# EAGLE schematic controller_rev1.1(flat) (EAGLE 9.0.0)

## Sheet 1 of 3
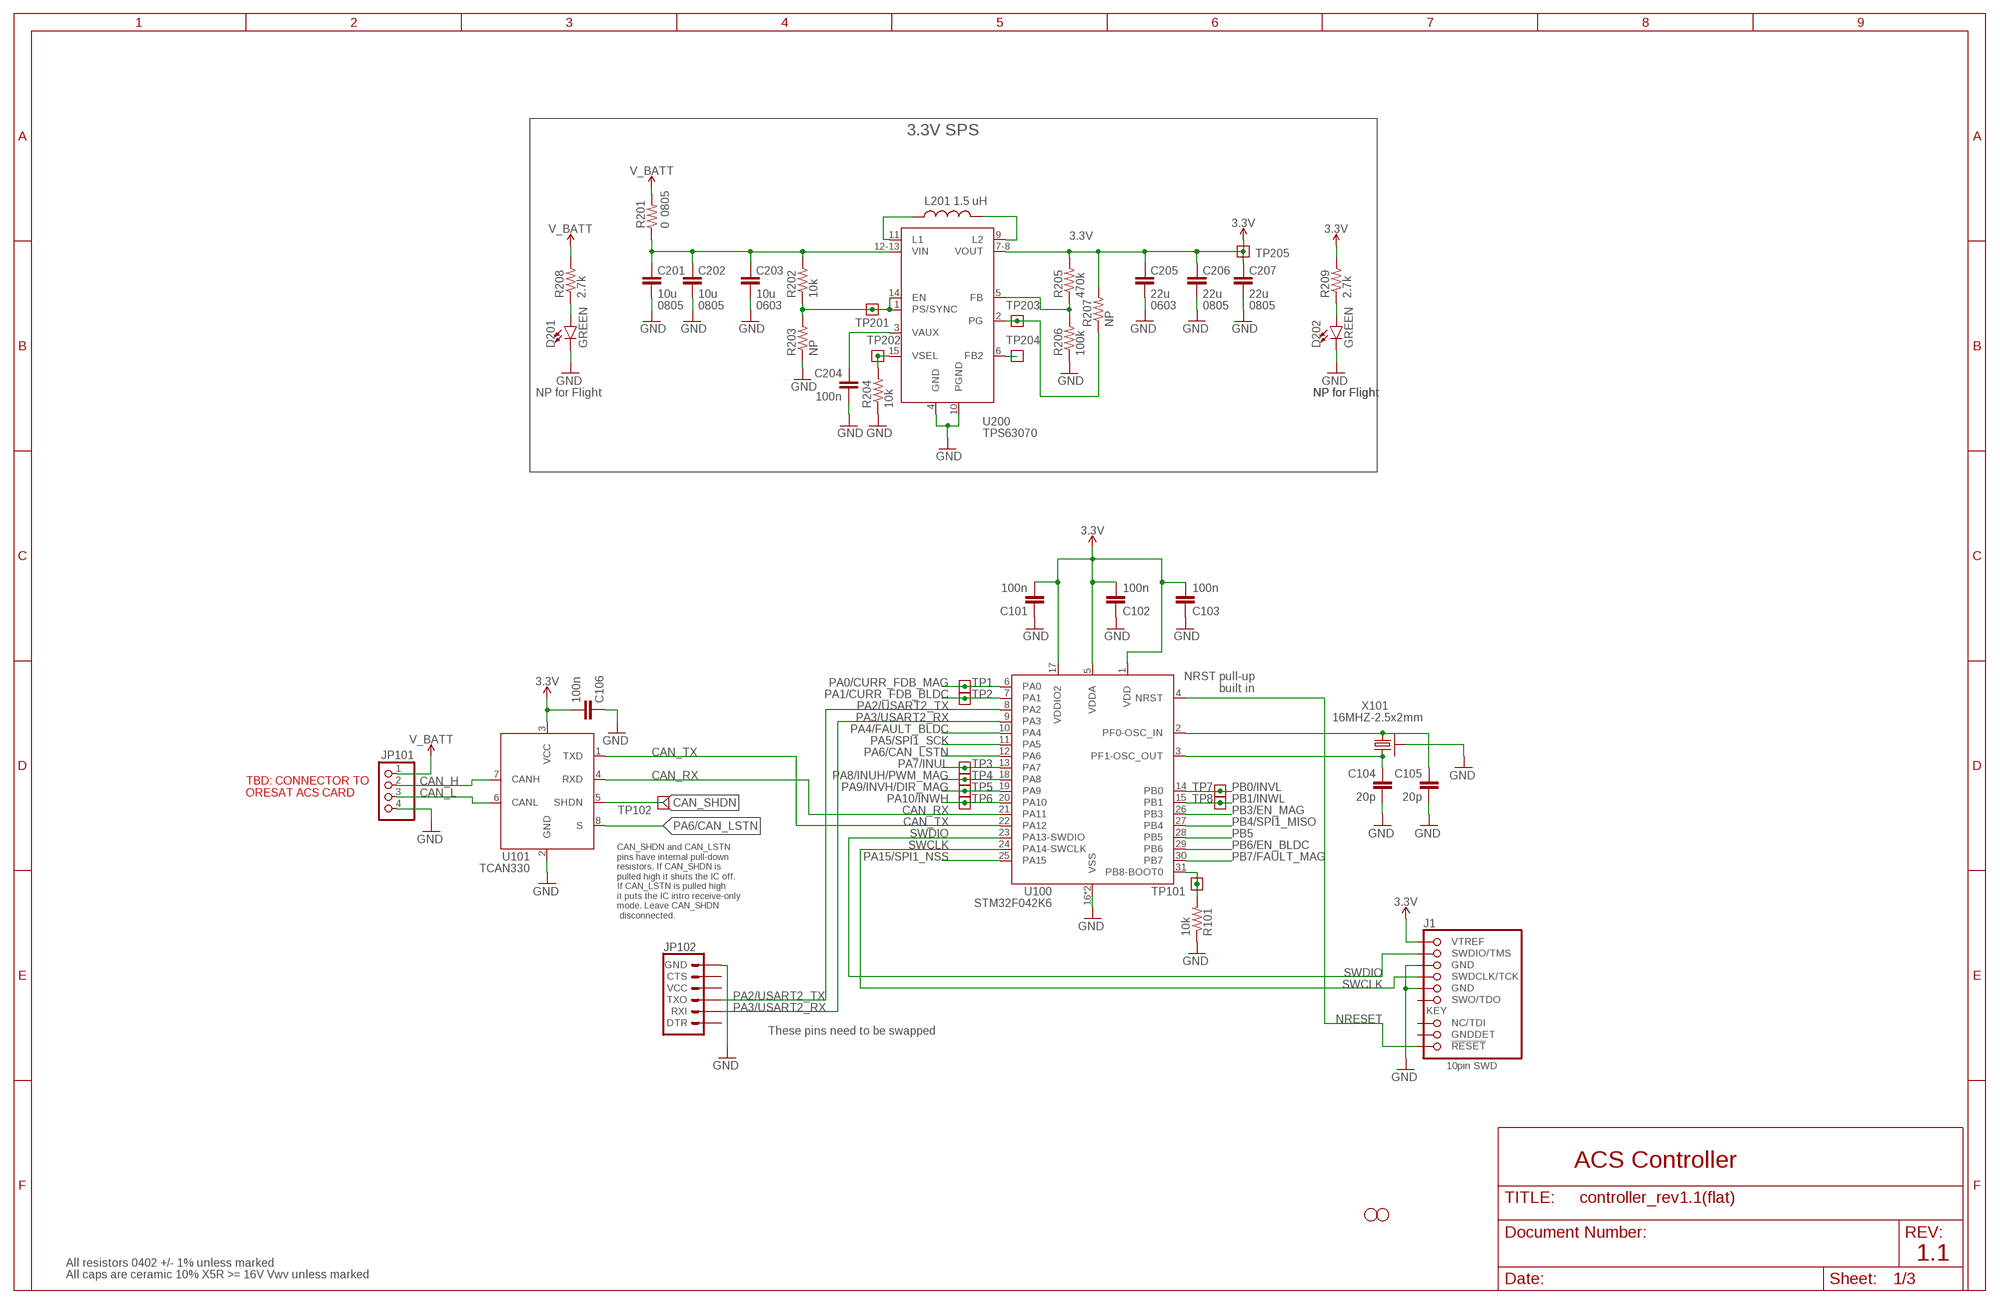
[diagram p0: schematic, sheet 1]

### Parts
C101  100n  C-EU0402-B-NOSILK  [.0402-B-NOSILK]
C102  100n  C-EU0402-B-NOSILK  [.0402-B-NOSILK]
C103  100n  C-EU0402-B-NOSILK  [.0402-B-NOSILK]
C104  20p  C-EU0402-B-NOSILK  [.0402-B-NOSILK]
C105  20p  C-EU0402-B-NOSILK  [.0402-B-NOSILK]
C106  100n  C-EU0402-B-NOSILK  [.0402-B-NOSILK]
C201  10u  C-EU0805-B-NOSILK  [.0805-B-NOSILK]
C202  10u  C-EU0805-B-NOSILK  [.0805-B-NOSILK]
C203  10u  C-EU0603-B-NOSILK  [.0603-B-NOSILK]
C204  100n  C-EU0402-B-NOSILK  [.0402-B-NOSILK]
C205  22u  C-EU0603-B-NOSILK  [.0603-B-NOSILK]
C206  22u  C-EU0805-B-NOSILK  [.0805-B-NOSILK]
C207  22u  C-EU0805-B-NOSILK  [.0805-B-NOSILK]
D201  GREEN  LED-GREEN0603  [LED-0603]
D202  GREEN  LED-GREEN0603  [LED-0603]
H1  STAND-OFFTIGHT  [STAND-OFF-TIGHT]
H2  STAND-OFFTIGHT  [STAND-OFF-TIGHT]
J1  1.27MM-SWD-CONNECTOR  [1.27MM_2X5]
JP101  PINHD-1X4  [1X04]
JP102  6_PIN_SERIAL_TARGETSILK  [6_PIN_SERIAL_TARGET_SIDE_W_SILK]
L201  1.5 uH  L-COILCRAFT-XFL4020  [L-COILCRAFT-XFL4020]
R101  10k  R-US_0402-B-NOSILK  [.0402-B-NOSILK]
R201  0  R-US_0805-B-NOSILK  [.0805-B-NOSILK]
R202  10k  R-US_0402-B-NOSILK  [.0402-B-NOSILK]
R203  NP  R-US_0402-B-NOSILK  [.0402-B-NOSILK]
R204  10k  R-US_0402-B-NOSILK  [.0402-B-NOSILK]
R205  470k  R-US_0402-B-NOSILK  [.0402-B-NOSILK]
R206  100k  R-US_0402-B-NOSILK  [.0402-B-NOSILK]
R207  NP  R-US_0402-B-NOSILK  [.0402-B-NOSILK]
R208  2.7k  R-US_0402-B-NOSILK  [.0402-B-NOSILK]
R209  2.7k  R-US_0402-B-NOSILK  [.0402-B-NOSILK]
TP1  TEST-POINT  [2MM-TEST-POINT]
TP2  TEST-POINT  [2MM-TEST-POINT]
TP3  TEST-POINT  [2MM-TEST-POINT]
TP4  TEST-POINT  [2MM-TEST-POINT]
TP5  TEST-POINT  [2MM-TEST-POINT]
TP6  TEST-POINT  [2MM-TEST-POINT]
TP7  TEST-POINT  [2MM-TEST-POINT]
TP8  TEST-POINT  [2MM-TEST-POINT]
TP101  TEST-POINT  [2MM-TEST-POINT]
TP102  TEST-POINT  [2MM-TEST-POINT]
TP201  TEST-POINT  [2MM-TEST-POINT]
TP202  TEST-POINT  [2MM-TEST-POINT]
TP203  TEST-POINT  [2MM-TEST-POINT]
TP204  TEST-POINT  [2MM-TEST-POINT]
TP205  TEST-POINT  [2MM-TEST-POINT]
U100  STM32F042K6  [QFP32-7X7]
U101  TCAN330  [SOT23-8_TI-DCN]
U200  TPS63070  TPS63070X  [TPS63070X]
X101  16MHZ-2.5x2mm  CRYSTAL-WITH-GND  [CRYSTAL_2.5X2]

### Nets
3.3V: C101.2 C102.2 C103.2 C106.2 C205.1 C206.1 C207.1 J1.VTREF R205.2 R207.2 R209.2 TP205.1 U100.1(VDD) U100.5(VDDA) U100.17(VDDIO2) U101.3(VCC) U200.7-8(VOUT) ; also sheet 2,3
BOOT: R101.2 TP101.1 U100.31(PB8-BOOT0)
CAN_H: JP101.2 U101.7(CANH)
CAN_L: JP101.3 U101.6(CANL)
CAN_RX: U100.21(PA11) U101.4(RXD)
CAN_SHDN: TP102.1 U101.5(SHDN)
CAN_TX: U100.22(PA12) U101.1(TXD)
CRYSTALIN: C105.1 U100.2(PF0-OSC_IN) X101.1
CRYSTALOUT: C104.1 U100.3(PF1-OSC_OUT) X101.3
GND: C101.1 C102.1 C103.1 C104.2 C105.2 C106.1 C201.2 C202.2 C203.2 C204.2 C205.2 C206.2 C207.2 D201.C D202.C J1.GND J1.GND@2(GND) JP101.4 JP102.P$6(GND) R101.1 R203.1 R204.1 R206.1 U100.16(VSS) U100.32(VSS) U101.2(GND) U200.4(GND) U200.10(PGND) X101.2(SHIELD) X101.4(SHIELD) ; also sheet 2,3
N$270: D201.A R208.1
N$271: D202.A R209.1
NRESET: J1.!RESET U100.4(NRST)
PA0/CURR_FDB_MAG: TP1.1 U100.6(PA0) ; also sheet 3
PA1/CURR_FDB_BLDC: TP2.1 U100.7(PA1) ; also sheet 2
PA2/USART2_TX: JP102.P$2(TXO) U100.8(PA2)
PA3/USART2_RX: JP102.P$3(RXI) U100.9(PA3)
PA4/FAULT_BLDC: U100.10(PA4) ; also sheet 2
PA5/SPI1_SCK: U100.11(PA5) ; also sheet 2
PA6/CAN_LSTN: U100.12(PA6) U101.8(S)
PA7/INUL: TP3.1 U100.13(PA7) ; also sheet 2
PA8/INUH/PWM_MAG: TP4.1 U100.18(PA8) ; also sheet 2,3
PA9/INVH/DIR_MAG: TP5.1 U100.19(PA9) ; also sheet 2,3
PA10/INWH: TP6.1 U100.20(PA10) ; also sheet 2
PA15/SPI1_NSS: U100.25(PA15) ; also sheet 2
PB0/INVL: TP7.1 U100.14(PB0) ; also sheet 2
PB1/INWL: TP8.1 U100.15(PB1) ; also sheet 2
PB3/EN_MAG: U100.26(PB3) ; also sheet 3
PB4/SPI1_MISO: U100.27(PB4) ; also sheet 2
PB5: U100.28(PB5)
PB6/EN_BLDC: U100.29(PB6) ; also sheet 2
PB7/FAULT_MAG: U100.30(PB7) ; also sheet 3
SWCLK: J1.SWDCLK(SWDCLK/TCK) U100.24(PA14-SWCLK)
SWDIO: J1.SWDIO(SWDIO/TMS) U100.23(PA13-SWDIO)
TPS-EN: R202.1 R203.2 TP201.1 U200.1(PS/SYNC) U200.14(EN)
TPS-FB: R205.1 R206.2 U200.5(FB)
TPS-FB2: TP204.1 U200.6(FB2)
TPS-L1: L201.1 U200.11(L1)
TPS-L2: L201.2 U200.9(L2)
TPS-PG: R207.1 TP203.1 U200.2(PG)
TPS-VAUX: C204.1 U200.3(VAUX)
TPS-VIN: C201.1 C202.1 C203.1 R201.1 R202.2 U200.12-13(VIN)
TPS-VSEL: R204.2 TP202.1 U200.15(VSEL)
V_BATT: JP101.1 R201.2 R208.2 ; also sheet 2,3
Unconnected: J1.GNDDET J1.NC(NC/TDI) J1.SWO(SWO/TDO) JP102.P$1(DTR) JP102.P$4(VCC) JP102.P$5(CTS)

### Notes on the sheet
- 3.3V SPS
- 0805
- 0805 | 0805 | 0603 | 0603 | 0805 | 0805
- NP for Flight | NP for Flight | NP for Flight
- NRST pull-up
  built in
- TBD: CONNECTOR TO 
  ORESAT ACS CARD
- CAN_SHDN and CAN_LSTN
  pins have internal pull-down
  resistors. If CAN_SHDN is 
  pulled high it shuts the IC off.
  If CAN_LSTN is pulled high
  it puts the IC intro receive-only
  mode. Leave CAN_SHDN
   disconnected.
- These pins need to be swapped
- ACS Controller
- 1.1
- All resistors 0402 +/- 1% unless marked
- All caps are ceramic 10% X5R >= 16V Vwv unless marked

## Sheet 2 of 3
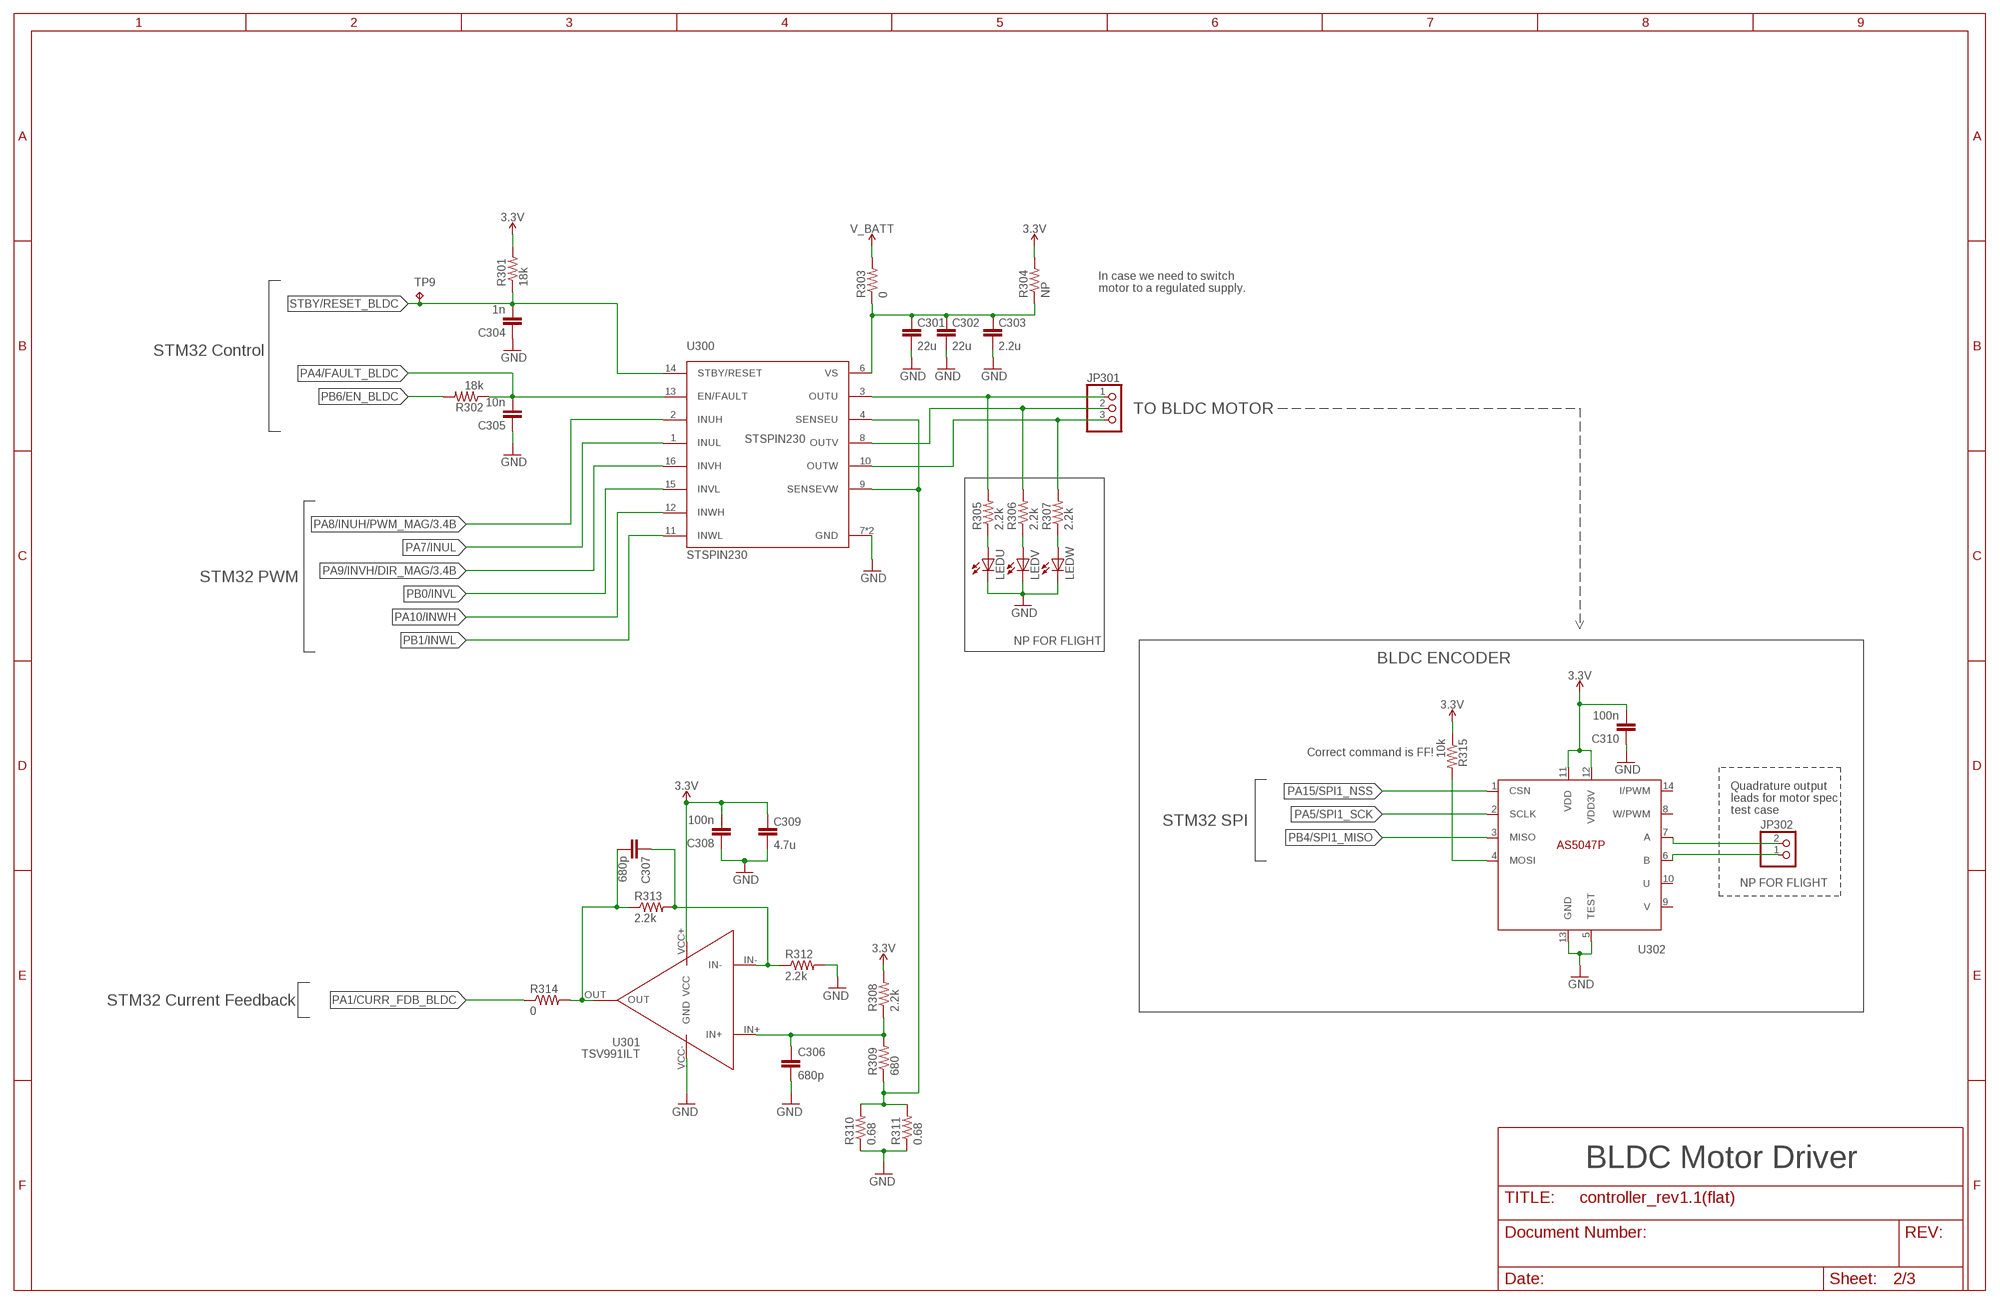
[diagram p1: schematic, sheet 2]

### Parts
C301  22u  C-EU0603-B-NOSILK  [.0603-B-NOSILK]
C302  22u  C-EU0603-B-NOSILK  [.0603-B-NOSILK]
C303  2.2u  C-EU0603-B-NOSILK  [.0603-B-NOSILK]
C304  1n  C-EU0402-B-NOSILK  [.0402-B-NOSILK]
C305  10n  C-EU0402-B-NOSILK  [.0402-B-NOSILK]
C306  680p  C-EU0402-B-NOSILK  [.0402-B-NOSILK]
C307  680p  C-EU0402-B-NOSILK  [.0402-B-NOSILK]
C308  100n  C-EU0402-B-NOSILK  [.0402-B-NOSILK]
C309  4.7u  C-EU0603-B-NOSILK  [.0603-B-NOSILK]
C310  100n  C-EU0402-B-NOSILK  [.0402-B-NOSILK]
JP301  PINHD-1X3  [1X03]
JP302  PINHD-1X2/90  [1X02/90]
LEDU  LEDCHIP-LED0603  [CHIP-LED0603]
LEDV  LEDCHIP-LED0603  [CHIP-LED0603]
LEDW  LEDCHIP-LED0603  [CHIP-LED0603]
R301  18k  R-US_0402-B-NOSILK  [.0402-B-NOSILK]
R302  18k  R-US_0402-B-NOSILK  [.0402-B-NOSILK]
R303  0  R-US_0805-B-NOSILK  [.0805-B-NOSILK]
R304  NP  R-US_0805-B-NOSILK  [.0805-B-NOSILK]
R305  2.2k  R-US_0805-B-NOSILK  [.0805-B-NOSILK]
R306  2.2k  R-US_0805-B-NOSILK  [.0805-B-NOSILK]
R307  2.2k  R-US_0805-B-NOSILK  [.0805-B-NOSILK]
R308  2.2k  R-US_0402-B-NOSILK  [.0402-B-NOSILK]
R309  680  R-US_0402-B-NOSILK  [.0402-B-NOSILK]
R310  0.68  R-US_0805-B-NOSILK  [.0805-B-NOSILK]
R311  0.68  R-US_0805-B-NOSILK  [.0805-B-NOSILK]
R312  2.2k  R-US_0402-B-NOSILK  [.0402-B-NOSILK]
R313  2.2k  R-US_0402-B-NOSILK  [.0402-B-NOSILK]
R314  0  R-US_0402-B-NOSILK  [.0402-B-NOSILK]
R315  10k  R-US_0402-B-NOSILK  [.0402-B-NOSILK]
TP9  TPPAD1-13  [P1-13]
U300  STSPIN230  [VFQFPN]
U301  TSV991ILT  [SOT23-5]
U302  AS5047P  [TSSOP14]

### Nets
3.3V: C308.2 C309.1 C310.2 R301.2 R304.2 R308.2 R315.1 U301.VCC+(VCC) U302.11(VDD) U302.12(VDD3V) ; also sheet 1,3
GND: C301.2 C302.2 C303.2 C304.1 C305.1 C306.2 C308.1 C309.2 C310.1 LEDU.C LEDV.C LEDW.C R310.1 R311.1 R312.2 U300.7(GND) U300.EPAD(GND) U301.VCC-(GND) U302.5(TEST) U302.13(GND) ; also sheet 1,3
N$1: R315.2 U302.4(MOSI)
N$4: JP302.2 U302.7(A)
N$6: LEDU.A R305.1
N$10: LEDV.A R306.1
N$11: LEDW.A R307.1
N$12: C301.1 C302.1 C303.1 R303.1 R304.1 U300.6(VS)
N$13: JP302.1 U302.6(B)
N$14: C307.1 R312.1 R313.2 U301.IN-
N$16: C306.1 R308.1 R309.2 U301.IN+
N$29: C307.2 R313.1 R314.2 U301.OUT
PA1/CURR_FDB_BLDC: R314.1 ; also sheet 1
PA4/FAULT_BLDC: C305.2 R302.1 U300.13(EN/FAULT) ; also sheet 1
PA5/SPI1_SCK: U302.2(SCLK) ; also sheet 1
PA7/INUL: U300.1(INUL) ; also sheet 1
PA8/INUH/PWM_MAG: U300.2(INUH) ; also sheet 1,3
PA9/INVH/DIR_MAG: U300.16(INVH) ; also sheet 1,3
PA10/INWH: U300.12(INWH) ; also sheet 1
PA15/SPI1_NSS: U302.1(CSN) ; also sheet 1
PB0/INVL: U300.15(INVL) ; also sheet 1
PB1/INWL: U300.11(INWL) ; also sheet 1
PB4/SPI1_MISO: U302.3(MISO) ; also sheet 1
PB6/EN_BLDC: R302.2 ; also sheet 1
SENSE_BLDC: R309.1 R310.2 R311.2 U300.4(SENSEU) U300.9(SENSEVW)
STBY/RESET_BLDC: C304.2 R301.1 TP9.TP U300.14(STBY/RESET)
U: JP301.1 R305.2 U300.3(OUTU)
V: JP301.2 R306.2 U300.8(OUTV)
V_BATT: R303.2 ; also sheet 1,3
W: JP301.3 R307.2 U300.10(OUTW)
Unconnected: U302.8(W/PWM) U302.9(V) U302.10(U) U302.14(I/PWM)

### Notes on the sheet
- In case we need to switch 
  motor to a regulated supply.
- STM32 Control
- TO BLDC MOTOR
- STM32 PWM
- NP FOR FLIGHT
- BLDC ENCODER
- Correct command is FF!
- Quadrature output
  leads for motor spec
  test case
- STM32 SPI
- NP FOR FLIGHT
- STM32 Current Feedback
- BLDC Motor Driver

## Sheet 3 of 3
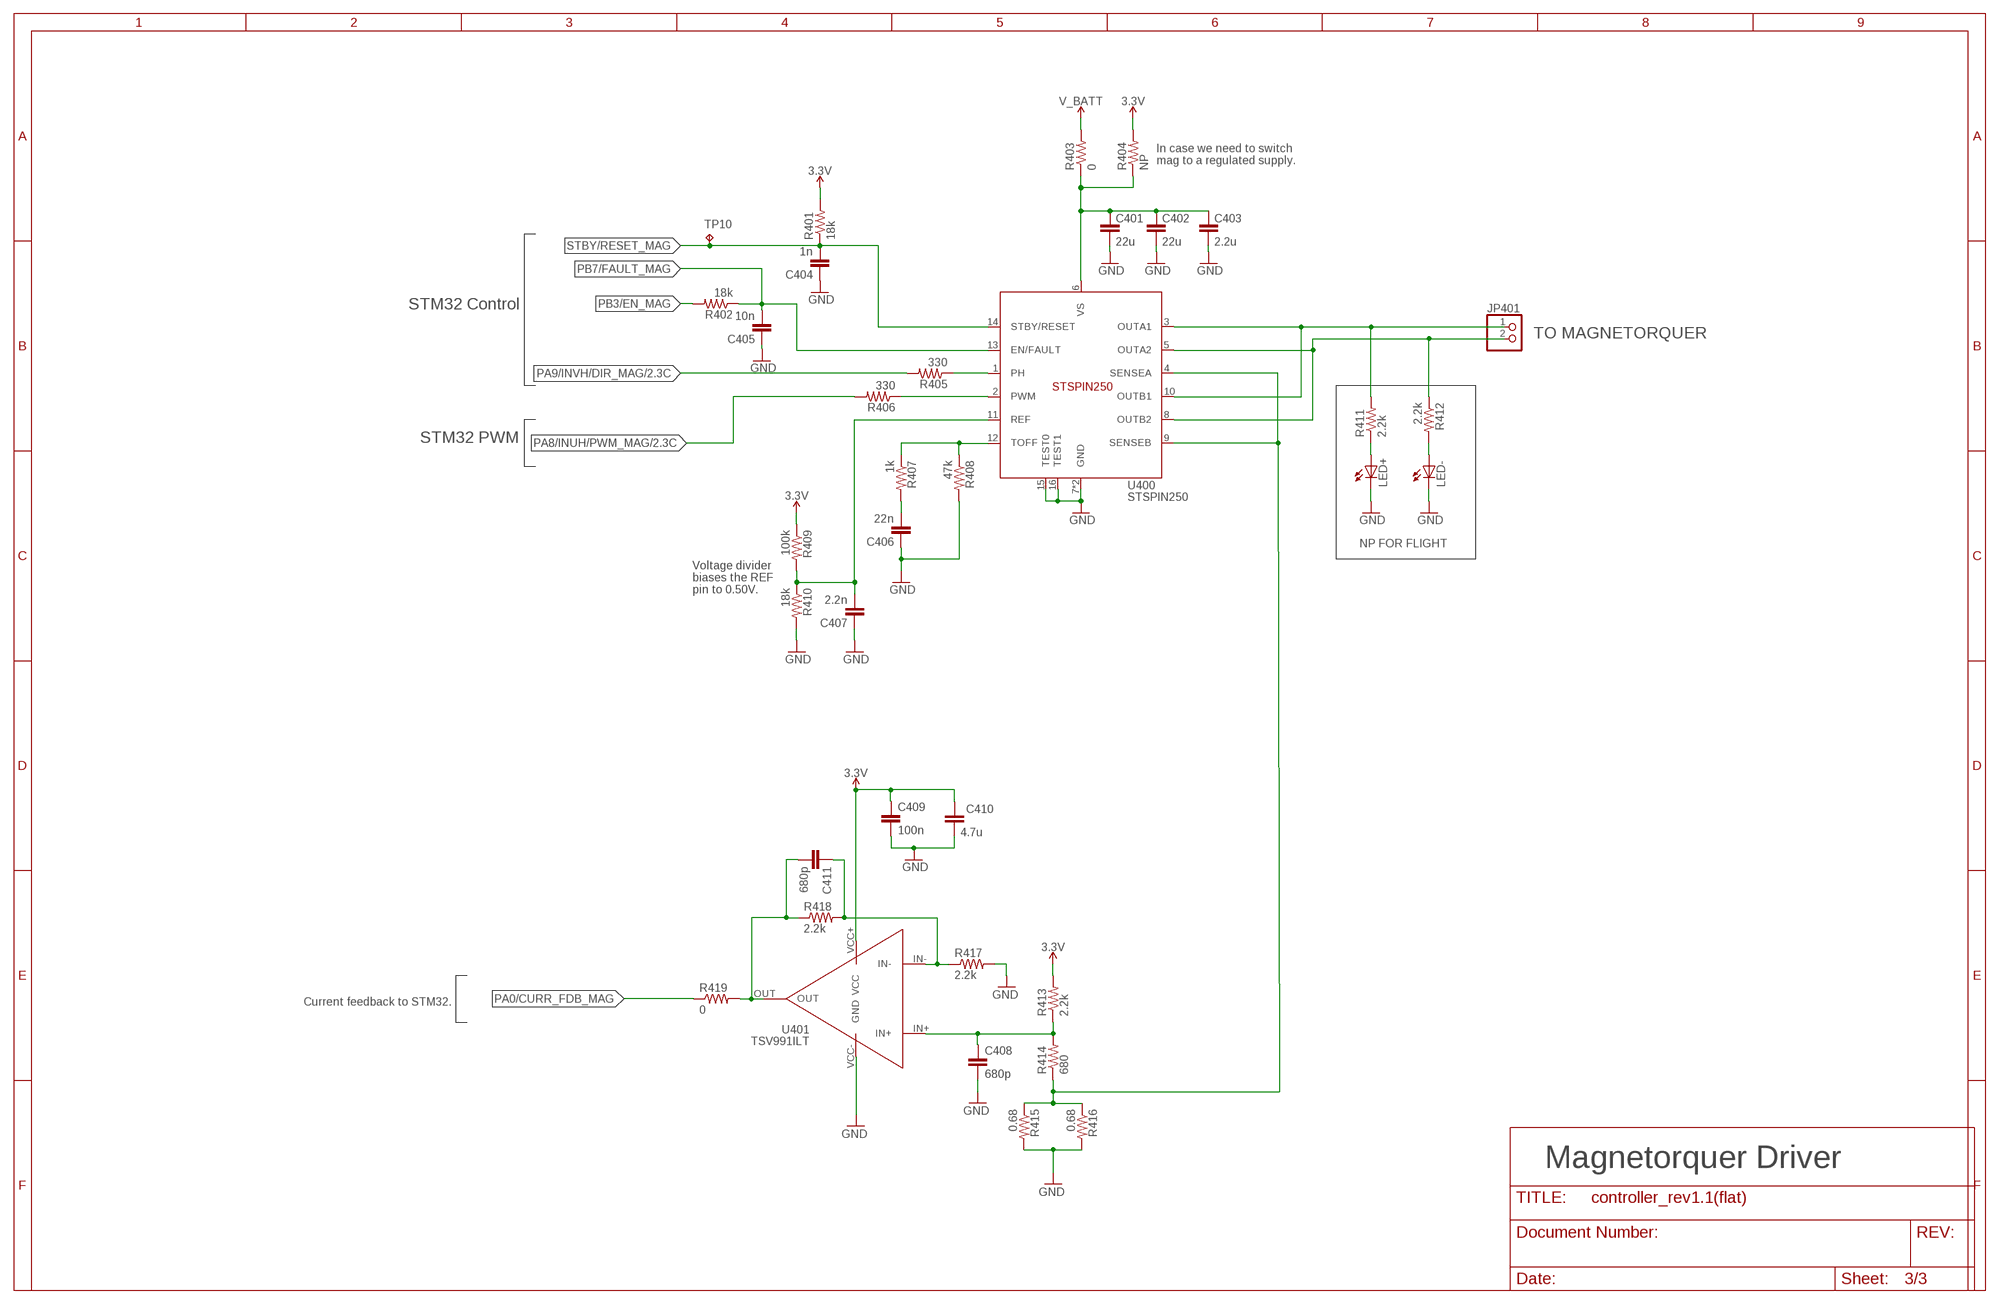
[diagram p2: schematic, sheet 3]

### Parts
C401  22u  C-EU0603-B-NOSILK  [.0603-B-NOSILK]
C402  22u  C-EU0603-B-NOSILK  [.0603-B-NOSILK]
C403  2.2u  C-EU0603-B-NOSILK  [.0603-B-NOSILK]
C404  1n  C-EU0402-B-NOSILK  [.0402-B-NOSILK]
C405  10n  C-EU0402-B-NOSILK  [.0402-B-NOSILK]
C406  22n  C-EU0402-B-NOSILK  [.0402-B-NOSILK]
C407  2.2n  C-EU0402-B-NOSILK  [.0402-B-NOSILK]
C408  680p  C-EU0402-B-NOSILK  [.0402-B-NOSILK]
C409  100n  C-EU0402-B-NOSILK  [.0402-B-NOSILK]
C410  4.7u  C-EU0603-B-NOSILK  [.0603-B-NOSILK]
C411  680p  C-EU0402-B-NOSILK  [.0402-B-NOSILK]
JP401  PINHD-1X2  [1X02]
LED+  LEDCHIP-LED0603  [CHIP-LED0603]
LED-  LEDCHIP-LED0603  [CHIP-LED0603]
R401  18k  R-US_0402-B-NOSILK  [.0402-B-NOSILK]
R402  18k  R-US_0402-B-NOSILK  [.0402-B-NOSILK]
R403  0  R-US_0805-B-NOSILK  [.0805-B-NOSILK]
R404  NP  R-US_0805-B-NOSILK  [.0805-B-NOSILK]
R405  330  R-US_0402-B-NOSILK  [.0402-B-NOSILK]
R406  330  R-US_0402-B-NOSILK  [.0402-B-NOSILK]
R407  1k  R-US_0402-B-NOSILK  [.0402-B-NOSILK]
R408  47k  R-US_0402-B-NOSILK  [.0402-B-NOSILK]
R409  100k  R-US_0402-B-NOSILK  [.0402-B-NOSILK]
R410  18k  R-US_0402-B-NOSILK  [.0402-B-NOSILK]
R411  2.2k  R-US_0805-B-NOSILK  [.0805-B-NOSILK]
R412  2.2k  R-US_0805-B-NOSILK  [.0805-B-NOSILK]
R413  2.2k  R-US_0402-B-NOSILK  [.0402-B-NOSILK]
R414  680  R-US_0402-B-NOSILK  [.0402-B-NOSILK]
R415  0.68  R-US_0805-B-NOSILK  [.0805-B-NOSILK]
R416  0.68  R-US_0805-B-NOSILK  [.0805-B-NOSILK]
R417  2.2k  R-US_0402-B-NOSILK  [.0402-B-NOSILK]
R418  2.2k  R-US_0402-B-NOSILK  [.0402-B-NOSILK]
R419  0  R-US_0402-B-NOSILK  [.0402-B-NOSILK]
TP10  TPPAD1-13  [P1-13]
U400  STSPIN250  [VFQPN]
U401  TSV991ILT  [SOT23-5]

### Nets
3.3V: C409.1 C410.1 R401.2 R404.2 R409.1 R413.2 U401.VCC+(VCC) ; also sheet 1,2
GND: C401.2 C402.2 C403.2 C404.1 C405.1 C406.1 C407.1 C408.2 C409.2 C410.2 LED+.C LED-.C R408.2 R410.2 R415.2 R416.2 R417.2 U400.7(GND) U400.15(TEST0) U400.16(TEST1) U400.EPAD(GND) U401.VCC-(GND) ; also sheet 1,2
N$2: C406.2 R407.2
N$3: R406.1 U400.2(PWM)
N$5: R405.1 U400.1(PH)
N$15: C408.1 R413.1 R414.2 U401.IN+
N$17: C411.1 R417.1 R418.2 U401.IN-
N$19: R407.1 R408.1 U400.12(TOFF)
N$20: C401.1 C402.1 C403.1 R403.1 R404.1 U400.6(VS)
N$22: LED+.A R411.1
N$23: LED-.A R412.2
N$25: C407.2 R409.2 R410.1 U400.11(REF)
N$27: C411.2 R418.1 R419.2 U401.OUT
OUT1: JP401.1 R411.2 U400.3(OUTA1) U400.10(OUTB1)
OUT2: JP401.2 R412.1 U400.5(OUTA2) U400.8(OUTB2)
PA0/CURR_FDB_MAG: R419.1 ; also sheet 1
PA8/INUH/PWM_MAG: R406.2 ; also sheet 1,2
PA9/INVH/DIR_MAG: R405.2 ; also sheet 1,2
PB3/EN_MAG: R402.2 ; also sheet 1
PB7/FAULT_MAG: C405.2 R402.1 U400.13(EN/FAULT) ; also sheet 1
SENSE_MAG: R414.1 R415.1 R416.1 U400.4(SENSEA) U400.9(SENSEB)
STBY/RESET_MAG: C404.2 R401.1 TP10.TP U400.14(STBY/RESET)
V_BATT: R403.2 ; also sheet 1,2

### Notes on the sheet
- In case we need to switch 
  mag to a regulated supply.
- STM32 Control
- TO MAGNETORQUER
- STM32 PWM
- NP FOR FLIGHT
- Voltage divider
  biases the REF
  pin to 0.50V.
- Current feedback to STM32.
- Magnetorquer Driver

## Library data of the parts
C101-C103 C106 C204 C304-C308 C310 C404-C409 C411 = rcl_custom:C-EU: CAPACITOR, European symbol; DIS: Digi-Key; DPN: 1276-1001-1-ND; MFR: Samsung; MPN: CL05B104KO5NNNC
C104 C105 = rcl_custom:C-EU: CAPACITOR, European symbol; DIS: Digi-Key; DPN: 1276-6601-1-ND; MFR: Samsung; MPN: CL05C200JB51PNC
C201 C202 C206 C207 = oresat-rcl:C-EU: CAPACITOR, European symbol
C203 C205 C301-C303 C309 C401-C403 C410 = oresat-rcl:C-EU: CAPACITOR, European symbol; DIS: Digi-Key; DPN: 1276-1001-1-ND; MFR: Samsung; MPN: CL05B104KO5NNNC
D201 D202 = SparkFun-LED:LED-GREEN: Green SMD LED Used in manufacturing of various products at SparkFun Packages: 0603 - SMD 0603 package [Product Link] <http://www.futureelectronics.com/en/technologies/semiconductors/optoelectronics/leds/Pages/9894312-LTST-C190GKT.aspx?CrossPart=HSMG-C190&IM=0> LilyPad 1206 - SMD1206 LilyPad package [Product Link] <http://www.futureelectronics.com/en/Technologies/Product.aspx?ProductID=IN150NGHARVATEKCORPORATION2049943&IM=0> 1206 - SMD1206 package [Product Link] <http://www.futureelectronics.com/en/technologies/semiconductors/optoelectronics/leds/Pages/8315665-LTST-C150KGKT.aspx?IM=0> 1206 Bottom Mount -SMD 1206 Bottom Mount [Product Link] <http://www.digikey.com/product-detail/en/lite-on-inc/LTST-C230KGKT/160-1456-1-ND/386854> SparkFun Products: Pro Mini 328 -5V <https://www.sparkfun.com/products/821> RedBoard <https://www.sparkfun.com/products/12757> MP3 Trigger <https://www.sparkfun.com/products/13720> Makey Makey <https://www.sparkfun.com/products/11076>; PROD_ID: DIO-00821
H1 H2 = SparkFun-Hardware:STAND-OFF: Stand Off Drill holes for mechanically mounting via screws, standoffs, etc. Note: Use the keepout ring to avoid running the screw head into surrounding components. Variant Overviews STAND-OFF - Mechanical footprint for a #4 phillips button head screw. STAND-OFF-TIGHT - Mechanical footprint for a #4 phillips button head screw, Example SparkFun Products Screw - Phillips Head (1/4", 4-40, 10 pack) <https://www.sparkfun.com/products/10453> (PRT-10453) Screw - Phillips Head (1/2", 4-40, 10 pack) <https://www.sparkfun.com/products/10452> (PRT-10452) Screw - Phillips Head (3/4", 4-40, 10 pack) <https://www.sparkfun.com/products/10451> (PRT-10451) Screw - Phillips Head (1", 4-40, 10 pack) <https://www.sparkfun.com/products/10450> (PRT-10450)
J1 = J-CNC-3220-10-0100-00-ARM-SWD-port:1.27MM-SWD-CONNECTOR: ARM SWD Programming Header. Example part is the CNC 3220-10-0100-00
JP101 = pinhead:PINHD-1X4: PIN HEADER
JP102 = SparkFun-Connectors:6_PIN_SERIAL_TARGET: 6-pin header connection for use with the "FTDI BASIC" pinout - TARGET SIDE. Also known as "Arduino Serial Program Header". It is used to mate with our FTDI Basic serial programmers using the Arduino IDE. Note, this device has "TARGET" in the name. It is intended to be used on a design that contains a target micro-controller that you wish to program. The "sister" device, named "CABLE" is inteneded to be used on a design that usually lives on the end of your USB cable and prvides the converter chip (FTDI232 or FTDI231x) to commnicate serial RX/TX. You can populate with some of these: Break Away Headers - Straight <https://www.sparkfun.com/products/116> (PRT-00116) For reference (or to suit your programming needs) check out these designs: SparkFun FTDI Basic Breakout - 5V <https://www.sparkfun.com/products/9716> (DEV-09716) SparkFun FTDI Basic Breakout - 3.3V <https://www.sparkfun.com/products/9873> (DEV-09873) SparkFun FTDI SmartBasic <https://www.sparkfun.com/products/12935> (DEV-12935) SparkFun Beefy 3 - FTDI Basic Breakout <https://www.sparkfun.com/products/13746> (DEV-13746)
JP301 = pinhead:PINHD-1X3: PIN HEADER
JP302 JP401 = pinhead:PINHD-1X2: PIN HEADER
L201 = L-Coilcraft-XFL4020:L-COILCRAFT-XFL4020; DIS: Mouser; DPN: 994-XFL4020-152MEB; MFR: Coilcraft; MPN: XFL4020-152ME
LED+ LED- LEDU LEDV LEDW = adafruit:LED: LED OSRAM: - CHIPLED LG R971, LG N971, LY N971, LG Q971, LY Q971, LO R971, LY R971 LH N974, LH R974 LS Q976, LO Q976, LY Q976 LO Q996 - Hyper CHIPLED LW Q18S LB Q993, LB Q99A, LB R99A - SideLED LS A670, LO A670, LY A670, LG A670, LP A670 LB A673, LV A673, LT A673, LW A673 LH A674 LY A675 LS A676, LA A676, LO A676, LY A676, LW A676 LS A679, LY A679, LG A679 - Hyper Micro SIDELED® LS Y876, LA Y876, LO Y876, LY Y876 LT Y87S - SmartLED LW L88C, LW L88S LB L89C, LB L89S, LG L890 LS L89K, LO L89K, LY L89K LS L896, LA L896, LO L896, LY L896 - TOPLED LS T670, LO T670, LY T670, LG T670, LP T670 LSG T670, LSP T670, LSY T670, LOP T670, LYG T670 LG T671, LOG T671, LSG T671 LB T673, LV T673, LT T673, LW T673 LH T674 LS T676, LA T676, LO T676, LY T676, LB T676, LH T676, LSB T676, LW T676 LB T67C, LV T67C, LT T67C, LS T67K, LO T67K, LY T67K, LW E67C LS E67B, LA E67B, LO E67B, LY E67B, LB E67C, LV E67C, LT E67C LW T67C LS T679, LY T679, LG T679 LS T770, LO T770, LY T770, LG T770, LP T770 LB T773, LV T773, LT T773, LW T773 LH T774 LS E675, LA E675, LY E675, LS T675 LS T776, LA T776, LO T776, LY T776, LB T776 LHGB T686 LT T68C, LB T68C - Hyper Mini TOPLED® LB M676 - Mini TOPLED Santana® LG M470 LS M47K, LO M47K, LY M47K Source: http://www.osram.convergy.de/
R101 R202-R209 R301 R302 R308 R309 R312-R315 R401 R402 R405-R410 R413 R414 R417-R419 = rcl_custom:R-US_: RESISTOR, American symbol; DIS: Digi-Key; DPN: 1276-4275-1-ND; MFR: Samsung; MPN: RC1005F6653CS
R201 = rcl_custom:R-US_: RESISTOR, American symbol; DIS: Digi-Key; DPN: RHM0.0ARCT-ND; MFR: Rohm; MPN: MCR10EZPJ000
R303-R307 R310 R311 R403 R404 R411 R412 R415 R416 = oresat-rcl:R-US_: RESISTOR, American symbol
TP1-TP8 TP101 TP102 TP201-TP205 = Tova:TEST-POINT
TP9 TP10 = testpad:TP: Test pad
U100 = STM32F042K:STM32F042K6; DIS: Digi-Key; DPN: STM32F042K6T7-ND; MFR: STMicroelectronics; MPN: STM32F042K6T7
U101 = TCAN330:TCAN330; DIS: Digi-Key; DPN: 296-44211-1-ND; MFR: Texas Instruments; MPN: TCAN330GDCNT
U200 = ic-pwr-tps63070x:TPS63070X: TPS63070 2-V to 16-V Buck-Boost Converter With 3.6-A Switch Current
U300 = U-ST-STSPIN230-BLDC-controller:STSPIN230
U301 U401 = TSV991ILT:TSV991ILT
U302 = U-AMS-AS5047P-encoder:AS5047P
U400 = U-ST-STSPIN250-Brushed-DC-controller:STSPIN250
X101 = low-gain-radio:CRYSTAL-WITH-GND; DIS: Digi-Key; DPN: XC2181CT-ND; MFR: ECS Inc.; MPN: ECS-160-10-36Q-ES-TR